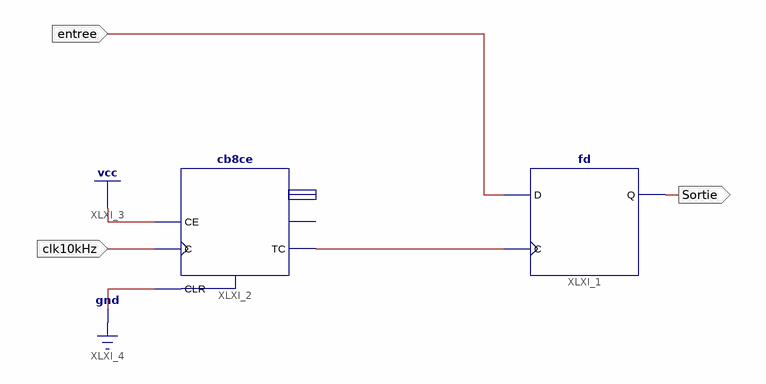
[diagram p0: schematic sheet 1]
// Xilinx ISE schematic AntiRebond.sch (xbr) as structural Verilog: 2 symbols, 3 ports
module AntiRebond (
  input  entree,
  input  clk10kHz,
  output Sortie
);

  wire XLXN_2;

  fd XLXI_1 (.C(XLXN_2), .D(entree), .Q(Sortie));
  cb8ce XLXI_2 (.C(clk10kHz), .CE(1'b1), .CLR(1'b0), .TC(XLXN_2));  // open: CEO, Q
endmodule
